# Altium schematic sheet Sheet6.SchDoc: solar-powered-remote-water-level-relay
size 419 x 297 mm; Date: 2026/06/29; Author: forlook88@gmail.com; Revision: 0; SheetNumber: 6; SheetTotal: 11
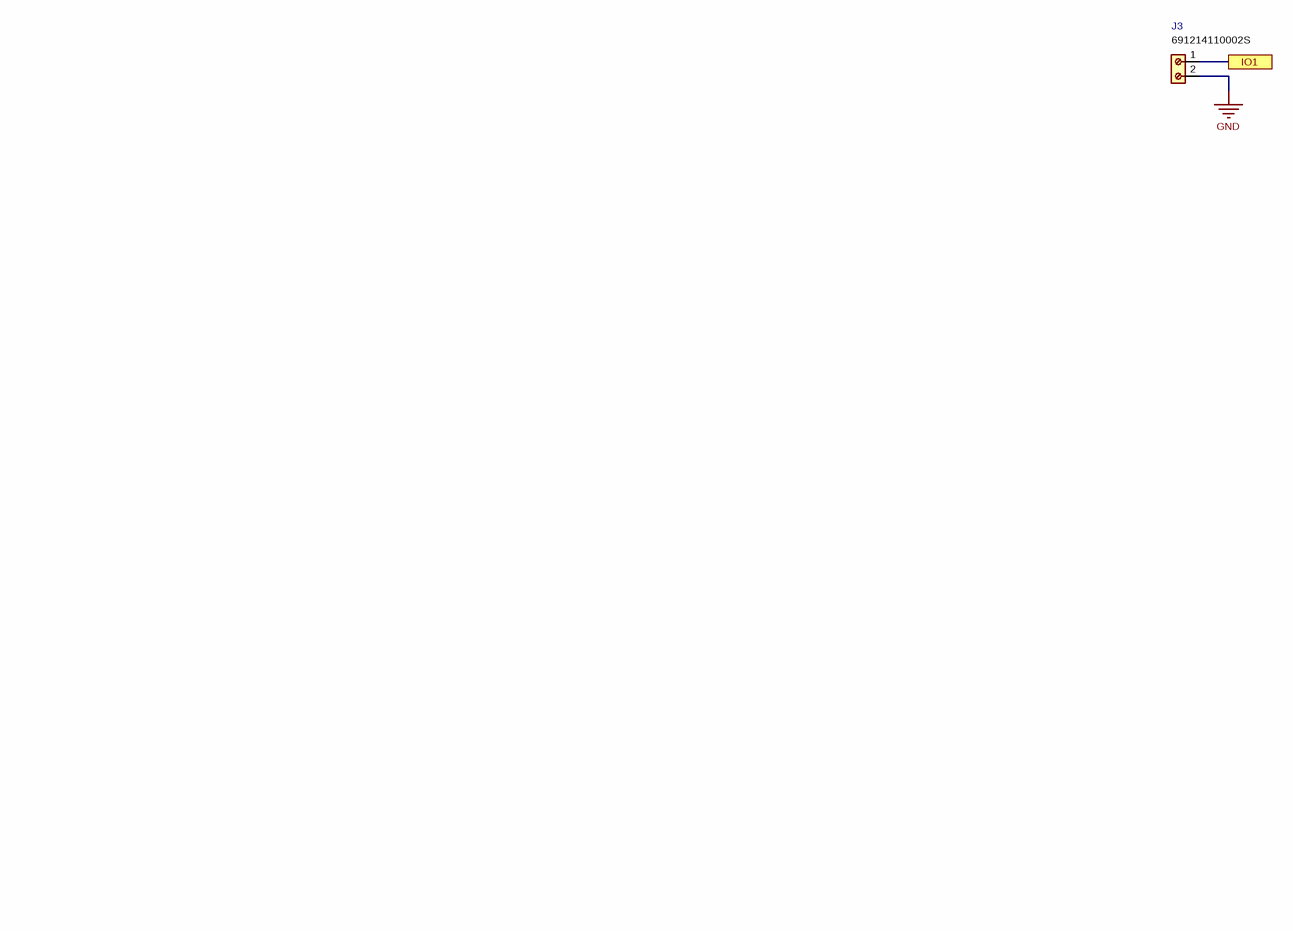
[diagram p0: Sheet6.SchDoc]

## Parts
J3  value 691214110002S

## Ports
IO1

## Nets
GND: J3.2
IO1: J3.1 ; port IO1

## Notes on the sheet
- Document Name:
- Project Name:
- Sheet Name:
- Sheet Number:
- Author:
- CELUS Design Platform electronic designs are machine-generated drafts and require verification by qualified specialists.
- of
- Revision:
- Date:
- By using these designs, you agree to the CELUS Terms of Use: https://www.celus.io/terms-of-use

## Library data of the parts
J3 = (no symbol name): Manufacturer: Würth Elektronik; Manufacturer Part Number: 691214110002S